# Altium schematic sheet ECUs.SchDoc
size A4; SheetNumber: 2; SheetTotal: 5
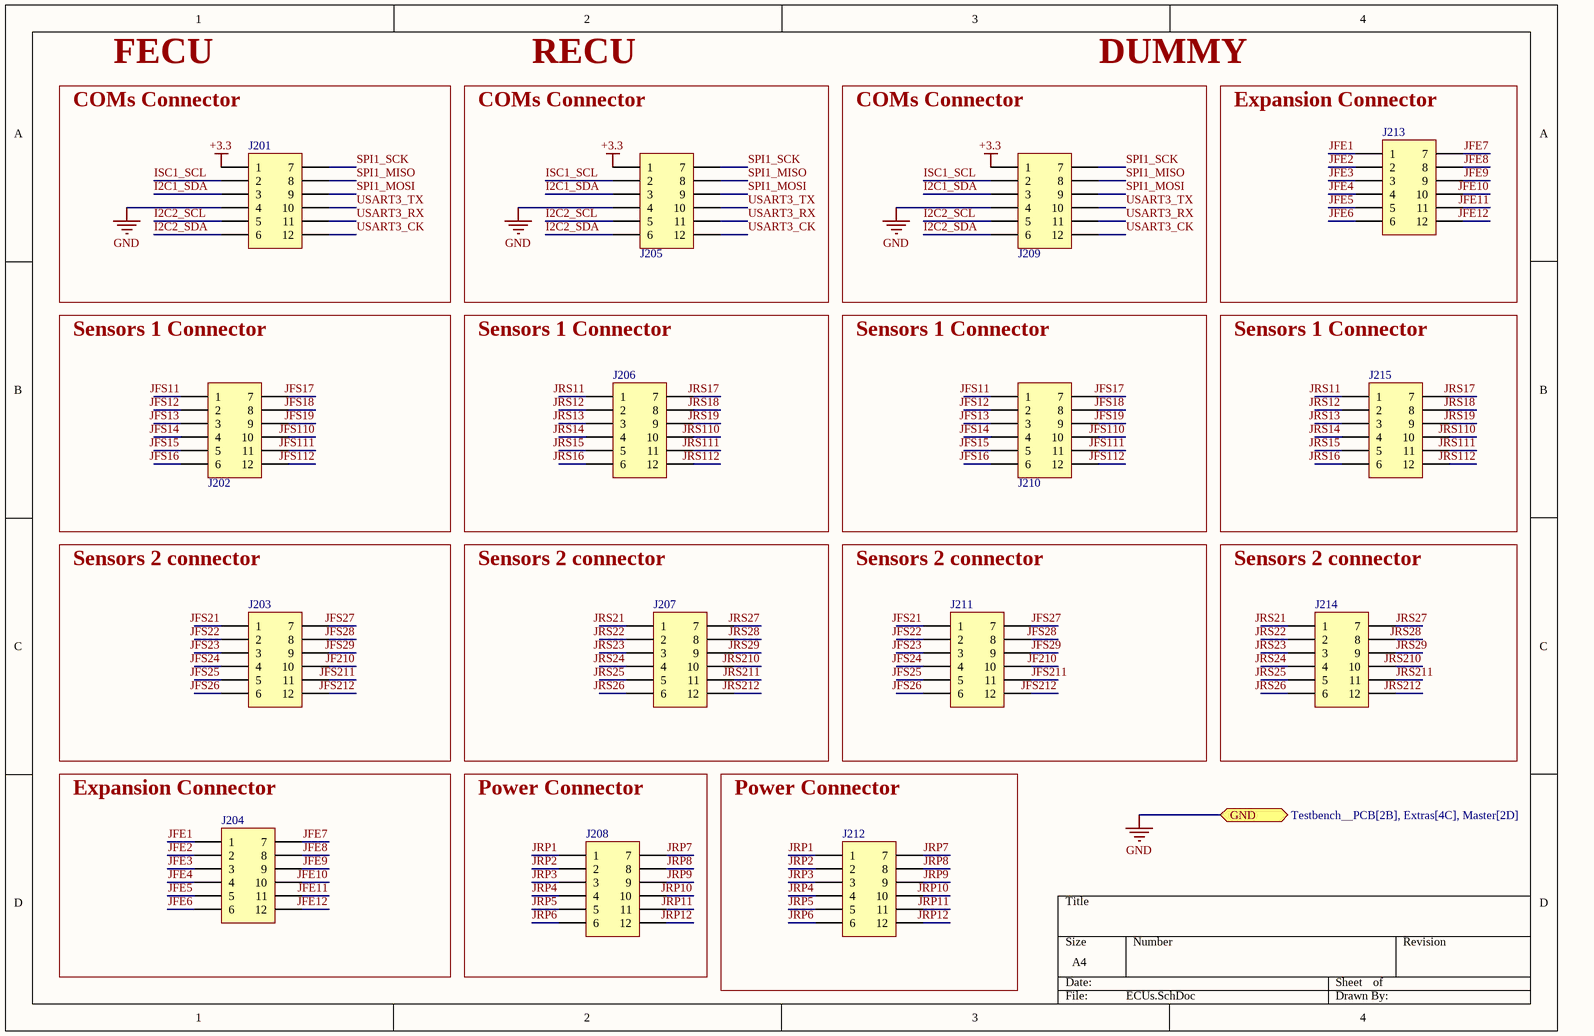
[diagram p0: ECUs.SchDoc]

## Parts
J201  1053101112  [J_NanoFit_2x6_V]  (value not drawn)
J202  1053101112  [J_NanoFit_2x6_V]  (value not drawn)
J203  1053101112  [J_NanoFit_2x6_V]  (value not drawn)
J204  1053101112  [J_NanoFit_2x6_V]  (value not drawn)
J205  1053101112  [J_NanoFit_2x6_V]  (value not drawn)
J206  1053101112  [J_NanoFit_2x6_V]  (value not drawn)
J207  1053101112  [J_NanoFit_2x6_V]  (value not drawn)
J208  1053101112  [J_NanoFit_2x6_V]  (value not drawn)
J209  1053101112  [J_NanoFit_2x6_V]  (value not drawn)
J210  1053101112  [J_NanoFit_2x6_V]  (value not drawn)
J211  1053101112  [J_NanoFit_2x6_V]  (value not drawn)
J212  1053101112  [J_NanoFit_2x6_V]  (value not drawn)
J213  1053101112  [J_NanoFit_2x6_V]  (value not drawn)
J214  1053101112  [J_NanoFit_2x6_V]  (value not drawn)
J215  1053101112  [J_NanoFit_2x6_V]  (value not drawn)

## Blocks framed on the sheet
FECU: J201
RECU: J205
DUMMY: J209
Expansion Connector: J213
Sensors 1 Connector: J202
Sensors 1 Connector: J206
Sensors 1 Connector: J210
Sensors 1 Connector: J215
Sensors 2 connector: J203
Sensors 2 connector: J207
Sensors 2 connector: J211
Sensors 2 connector: J214
Expansion Connector: J204
Power Connector: J208
Power Connector: J212

## Ports
GND (bidir, see Testbench__PCB[2B], Extras[4C], Master[2D])

## Nets
+3.3: J201.1 J205.1 J209.1
GND: J201.4 J205.4 J209.4 ; port GND
I2C1_SDA: J201.3 J205.3 J209.3
I2C2_SCL: J201.5 J205.5 J209.5
I2C2_SDA: J201.6 J205.6 J209.6
ISC1_SCL: J201.2 J205.2 J209.2
JF210: J203.10 J211.10
JFE1: J204.1 J213.1
JFE2: J204.2 J213.2
JFE3: J204.3 J213.3
JFE4: J204.4 J213.4
JFE5: J204.5 J213.5
JFE6: J204.6 J213.6
JFE7: J204.7 J213.7
JFE8: J204.8 J213.8
JFE9: J204.9 J213.9
JFE10: J204.10 J213.10
JFE11: J204.11 J213.11
JFE12: J204.12 J213.12
JFS11: J202.1 J210.1
JFS12: J202.2 J210.2
JFS13: J202.3 J210.3
JFS14: J202.4 J210.4
JFS15: J202.5 J210.5
JFS16: J202.6 J210.6
JFS17: J202.7 J210.7
JFS18: J202.8 J210.8
JFS19: J202.9 J210.9
JFS21: J203.1 J211.1
JFS22: J203.2 J211.2
JFS23: J203.3 J211.3
JFS24: J203.4 J211.4
JFS25: J203.5 J211.5
JFS26: J203.6 J211.6
JFS27: J203.7 J211.7
JFS28: J203.8 J211.8
JFS29: J203.9 J211.9
JFS110: J202.10 J210.10
JFS111: J202.11 J210.11
JFS112: J202.12 J210.12
JFS211: J203.11 J211.11
JFS212: J203.12 J211.12
JRP1: J208.1 J212.1
JRP2: J208.2 J212.2
JRP3: J208.3 J212.3
JRP4: J208.4 J212.4
JRP5: J208.5 J212.5
JRP6: J208.6 J212.6
JRP7: J208.7 J212.7
JRP8: J208.8 J212.8
JRP9: J208.9 J212.9
JRP10: J208.10 J212.10
JRP11: J208.11 J212.11
JRP12: J208.12 J212.12
JRS11: J206.1 J215.1
JRS12: J206.2 J215.2
JRS13: J206.3 J215.3
JRS14: J206.4 J215.4
JRS15: J206.5 J215.5
JRS16: J206.6 J215.6
JRS17: J206.7 J215.7
JRS18: J206.8 J215.8
JRS19: J206.9 J215.9
JRS21: J207.1 J214.1
JRS22: J207.2 J214.2
JRS23: J207.3 J214.3
JRS24: J207.4 J214.4
JRS25: J207.5 J214.5
JRS26: J207.6 J214.6
JRS27: J207.7 J214.7
JRS28: J207.8 J214.8
JRS29: J207.9 J214.9
JRS110: J206.10 J215.10
JRS111: J206.11 J215.11
JRS112: J206.12 J215.12
JRS210: J207.10 J214.10
JRS211: J207.11 J214.11
JRS212: J207.12 J214.12
SPI1_MISO: J201.8 J205.8 J209.8
SPI1_MOSI: J201.9 J205.9 J209.9
SPI1_SCK: J201.7 J205.7 J209.7
USART3_CK: J201.12 J205.12 J209.12
USART3_RX: J201.11 J205.11 J209.11
USART3_TX: J201.10 J205.10 J209.10

## Notes on the sheet
- COMs Connector

## Library data of the parts
J201-J215 = J_NanoFit_2x6_V: Nano-Fit Vertical Header, Through Hole, 2.50mm Pitch, Dual Row, 12 Circuits, with Kinked Pins, Tin (Sn) Plating, Black, Glow-Wire Capable, Tray